# Altium schematic sheet PhotoTrans.SchDoc
size A
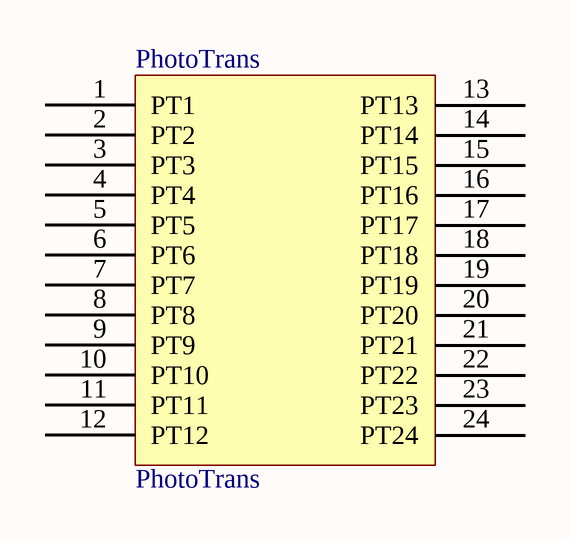
[diagram p0: PhotoTrans.SchDoc]

## Parts
PhotoTrans  PhotoTrans  [Docking Connector]

## Nets

Not connected (* = marked no-connect by the designer): PhotoTrans 1(PT1) 2(PT2) 3(PT3) 4(PT4) 5(PT5) 6(PT6) 7(PT7) 8(PT8) 9(PT9) 10(PT10) 11(PT11) 12(PT12) 13(PT13) 14(PT14) 15(PT15) 16(PT16) 17(PT17) 18(PT18) 19(PT19) 20(PT20) 21(PT21) 22(PT22) 23(PT23) 24(PT24)

## Library data of the parts
PhotoTrans = Docking Connector: 24 Pin Connector